# Altium schematic sheet 74HC595_Sch.SchDoc: 74HC595 Module
size 127 x 101 mm; Author: Hom; CompanyName: KitSprout; DrawnBy: Hom; Engineer: Hom; Organization: KitSprout; Revision: A; SheetNumber: 1; SheetTotal: 1; License: CC BY-SA 4.0; Version: 1.0; LibVersion: 1.0; PageSetup: Record=PageOptions|CenterHorizontal=True|CenterVertical=True|PrintScale=1.00|XCorrection=1.00|YCorrection=1.00|PrintKind=0|BorderSize=5000000|LeftOffset=0|BottomOffset=0|Orientation=2|PaperLength=1000|PaperWidth=1000|Scale=100|PaperSource=7|PrintQuality=-4|MediaType=1|DitherType=10|PaperKind=A4|PrintScaleMode=0
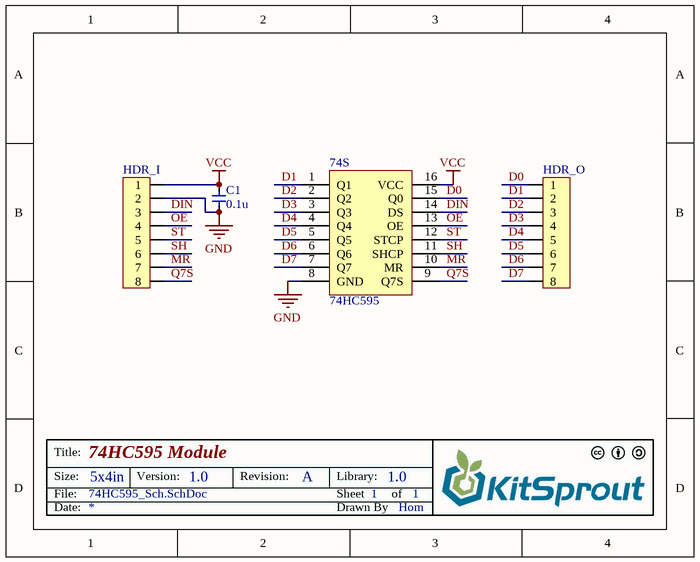
[diagram p0: 74HC595_Sch.SchDoc]

## Parts
74S  74HC595  [SOIC_E150_16]
C1  value 0.1u  [CAP_0603]  (hidden comment: Cap_0603)
HDR_I  HDR1x8_2.54  [HDR1X8_2.54_180]  (value not drawn)
HDR_O  HDR1x8_2.54  [HDR1X8_2.54_180]  (value not drawn)

## Nets
GND: 74S.8(GND) C1.1 HDR_I.2
VCC: 74S.16(VCC) C1.2 HDR_I.1
D0: 74S.15(Q0) HDR_O.1
D1: 74S.1(Q1) HDR_O.2
D2: 74S.2(Q2) HDR_O.3
D3: 74S.3(Q3) HDR_O.4
D4: 74S.4(Q4) HDR_O.5
D5: 74S.5(Q5) HDR_O.6
D6: 74S.6(Q6) HDR_O.7
D7: 74S.7(Q7) HDR_O.8
DIN: 74S.14(DS) HDR_I.3
MR: 74S.10(MR) HDR_I.7
OE: 74S.13(OE) HDR_I.4
Q7S: 74S.9(Q7S) HDR_I.8
SH: 74S.11(SHCP) HDR_I.6
ST: 74S.12(STCP) HDR_I.5

## Notes on the sheet
- Title:
- Size:
- Date:
- File:
- 5x4in
- Version:
- Revision:
- Sheet
- Drawn By
- Library:
- of

## Library data of the parts
74S = 74HC595: 74 Series
C1 = Cap_0603: Capacitor
HDR_I = HDR1x8_2.54T: Header
HDR_O = HDR1x8_2.54: Header